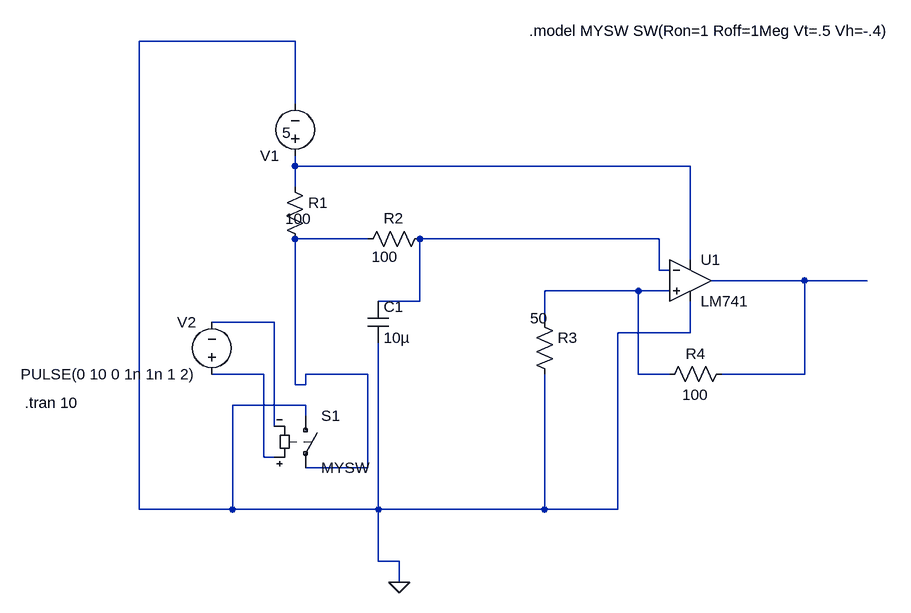
[diagram p0: schematic Debouncing.asc]
Debouncing.asc, the LTspice schematic file:
Version 4
SHEET 1 880 680
WIRE -80 -224 -320 -224
WIRE -80 -128 -80 -224
WIRE -80 -32 -80 -48
WIRE 528 -32 -80 -32
WIRE -80 0 -80 -32
WIRE 32 80 -80 80
WIRE 480 80 112 80
WIRE 528 112 528 -32
WIRE 480 128 480 80
WIRE 496 128 480 128
WIRE 704 144 560 144
WIRE 800 144 704 144
WIRE 448 160 304 160
WIRE 496 160 448 160
WIRE 112 176 112 80
WIRE 112 176 48 176
WIRE -112 208 -208 208
WIRE 304 208 304 160
WIRE 528 224 528 176
WIRE 528 224 416 224
WIRE -128 288 -208 288
WIRE 32 288 -64 288
WIRE 448 288 448 160
WIRE 496 288 448 288
WIRE 704 288 704 144
WIRE 704 288 576 288
WIRE -80 304 -80 80
WIRE -64 304 -64 288
WIRE -64 304 -80 304
WIRE -64 336 -176 336
WIRE -64 352 -64 336
WIRE -112 368 -112 208
WIRE -128 416 -128 288
WIRE -112 416 -128 416
WIRE 32 432 32 288
WIRE 32 432 -64 432
WIRE -320 496 -320 -224
WIRE -176 496 -176 336
WIRE -176 496 -320 496
WIRE 48 496 48 240
WIRE 48 496 -176 496
WIRE 304 496 304 288
WIRE 304 496 48 496
WIRE 416 496 416 224
WIRE 416 496 304 496
WIRE 48 576 48 496
WIRE 80 576 48 576
WIRE 80 608 80 576
FLAG 80 608 0
DATAFLAG 752 144 ""
SYMBOL OpAmps\\LM741 528 80 R0
SYMATTR InstName U1
SYMBOL voltage -80 -32 R180
WINDOW 3 6 51 Left 2
WINDOW 123 0 0 Left 0
WINDOW 39 0 0 Left 0
SYMATTR InstName V1
SYMATTR Value 5
SYMBOL res -96 -16 R0
WINDOW 3 1 65 Left 2
SYMATTR InstName R1
SYMATTR Value 100
SYMBOL res 128 64 R90
WINDOW 0 0 56 VBottom 2
WINDOW 3 28 70 VTop 2
SYMATTR InstName R2
SYMATTR Value 100
SYMBOL cap 32 176 R0
SYMATTR InstName C1
SYMATTR Value 10µ
SYMBOL res 288 192 R0
WINDOW 3 -6 10 Left 2
SYMATTR InstName R3
SYMATTR Value 50
SYMBOL res 592 272 R90
WINDOW 0 0 56 VBottom 2
WINDOW 3 32 56 VTop 2
SYMATTR InstName R4
SYMATTR Value 100
SYMBOL sw -64 336 R0
SYMATTR InstName S1
SYMATTR Value MYSW
SYMBOL voltage -208 304 R180
WINDOW 0 24 96 Left 2
WINDOW 3 24 16 Left 2
WINDOW 123 0 0 Left 0
WINDOW 39 0 0 Left 0
SYMATTR InstName V2
SYMATTR Value PULSE(0 10 0 1n 1n 1 2)
TEXT 280 -240 Left 2 !.model MYSW SW(Ron=1 Roff=1Meg Vt=.5 Vh=-.4)
TEXT -496 332 Left 2 !.tran 10

The netlist it stands for:
* Debouncing.asc
XU1 N005 N003 N001 0 N004 LM741  ; pins In+ In- V+ V- OUT
V1 N001 0 5
R1 N001 N002 100
R2 N003 N002 100
C1 N003 0 10µ
R3 N005 0 50
R4 N004 N005 100
S1 0 N002 N007 N006 MYSW
V2 N007 N006 PULSE(0 10 0 1n 1n 1 2)
.model MYSW SW(Ron=1 Roff=1Meg Vt=.5 Vh=-.4)
.tran 10
.lib LM741.lib
.backanno
.end